# Altium schematic sheet [01] Power Suppy.SchDoc
size A4
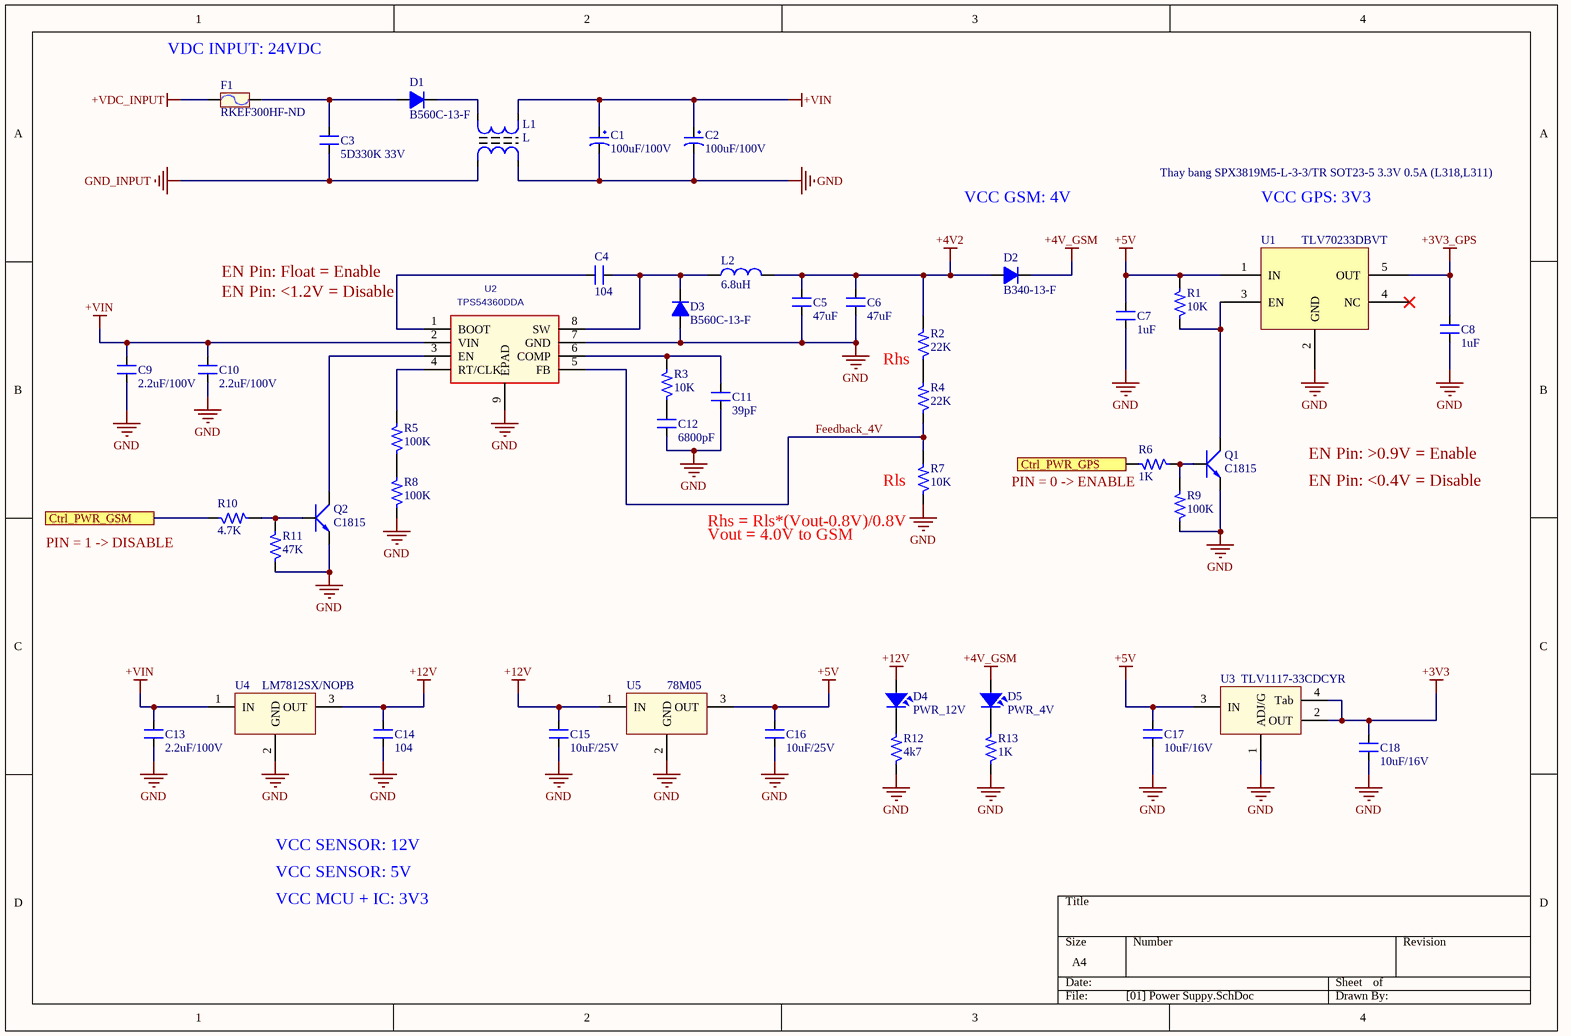
[diagram p0: [01] Power Suppy.SchDoc]

## Parts
C1  100uF/100V  [CP1.5/3.4]
C2  100uF/100V  [CP1.5/3.4]
C3  5D330K 33V  [CN2]
C4  104  [C0603 SMT]
C5  47uF  [SM-1210]
C6  47uF  [SM-1210]
C7  1uF  [CAP_0805]
C8  1uF  [CAP_0805]
C9  2.2uF/100V  [SM-1210]
C10  2.2uF/100V  [SM-1210]
C11  39pF  [CAP_0805]
C12  6800pF  [CAP_0805]
C13  2.2uF/100V  [SM-1210]
C14  104  [CAP_0805]
C15  10uF/25V  [CAP_0805]
C16  10uF/25V  [CAP_0805]
C17  10uF/16V  [CAP_0805]
C18  10uF/16V  [CAP_0805]
D1  B560C-13-F  [DO-214AB SMC]
D2  B340-13-F  [DO-214AB SMA]
D3  B560C-13-F  [DO-214AB SMC]
D4  PWR_12V  [LED-0805-Yellow]
D5  PWR_4V  [LED-0805-Green]
F1  RKEF300HF-ND  [FUSE2]
L1  L  [L2 UF9.8]
L2  6.8uH  [L01 SMD 12*12*6]
Q1  C1815  [SOT23B]
Q2  C1815  [SOT23B]
R1  10K  [RES-SMD-0805]
R2  22K  [RES-SMD-0805]
R3  10K  [RES-SMD-0805]
R4  22K  [RES-SMD-0805]
R5  100K  [RES-SMD-0805]
R6  1K  [RES-SMD-0805]
R7  10K  [RES-SMD-0805]
R8  100K  [RES-SMD-0805]
R9  100K  [RES-SMD-0805]
R10  4.7K  [RES-SMD-0805]
R11  47K  [RES-SMD-0805]
R12  4k7  [RES-SMD-0805]
R13  1K  [RES-SMD-0805]
U1  TLV70233DBVT  [TLV70233_3.3V]
U2  TPS54360DDA  [DDA8_3P1X2P4-M]
U3  TLV1117-33CDCYR  [SOT223-4N]
U4  LM7812SX/NOPB  [TO-263-4]
U5  78M05  [TO252-3L]

## Ports
Ctrl_PWR_GPS, Ctrl_PWR_GSM

## Nets
+3V3: C18.2 U3.2(OUT) U3.4(Tab)
+3V3_GPS: C8.2 U1.5(OUT)
+4V2: C5.2 C6.2 D2.1(A) L2.2 R2.2
+4V_GSM: D2.2(K) D5.1
+5V: C7.2 C16.2 C17.2 R1.2 U1.1(IN) U3.3(IN) U5.3(OUT)
+12V: C14.2 C15.2 D4.1 U4.3(OUT) U5.1(IN)
+VDC_INPUT: F1.1
+VIN: C1.1 C2.1 C9.2 C10.2 C13.2 L1.3 U2.2(VIN) U4.1(IN)
GND: C1.2 C2.2 C5.1 C6.1 C7.1 C8.1 C9.1 C10.1 C11.1 C12.1 C13.1 C14.1 C15.1 C16.1 C17.1 C18.1 D3.1(A) L1.2 Q1.1(E) Q2.1(E) R7.1 R8.1 R9.1 R11.1 R12.1 R13.1 U1.2(GND) U2.7(GND) U2.9(EPAD) U3.1(ADJ/G) U4.2(GND) U5.2(GND)
GND_INPUT: C3.1 L1.1
Ctrl_PWR_GPS: R6.2 ; port Ctrl_PWR_GPS
Ctrl_PWR_GSM: R10.1 ; port Ctrl_PWR_GSM
Feedback_4V: R4.1 R7.2 U2.5(FB)
NetC3_2: C3.2 D1.1(A) F1.2
NetC4_1: C4.1 U2.1(BOOT)
NetC4_2: C4.2 D3.2(K) L2.1 U2.8(SW)
NetC11_2: C11.2 R3.2 U2.6(COMP)
NetC12_2: C12.2 R3.1
NetD1_2: D1.2(K) L1.4
NetD4_2: D4.2 R12.2
NetD5_2: D5.2 R13.2
NetQ1_2: Q1.2(C) R1.1 U1.3(EN)
NetQ1_3: Q1.3(B) R6.1 R9.2
NetQ2_2: Q2.2(C) U2.3(EN)
NetQ2_3: Q2.3(B) R10.2 R11.2
NetR2_1: R2.1 R4.2
NetR5_1: R5.1 R8.2
NetR5_2: R5.2 U2.4(RT/CLK)

Not connected (* = marked no-connect by the designer): U1 4(NC)*

## Notes on the sheet
- (near F1) VDC INPUT: 24VDC
- Thay bang SPX3819M5-L-3-3/TR SOT23-5 3.3V 0.5A (L318,L311)
- VCC GSM: 4V
- VCC GPS: 3V3
- EN Pin: Float = Enable
- EN Pin: <1.2V = Disable
- Rhs
- (near R7) Rls
- (near R6) PIN = 0 -> ENABLE
- EN Pin: >0.9V = Enable
- EN Pin: <0.4V = Disable
- (near R10) PIN = 1 -> DISABLE
- (near R7) Rhs = Rls*(Vout-0.8V)/0.8V
- Vout = 4.0V to GSM
- VCC SENSOR: 12V
- VCC SENSOR: 5V
- VCC MCU + IC: 3V3

## Library data of the parts
C1 C2 = CP3: Cap 100uF/35V - 470uF/16V; Value: 100uF/35V/50V; Description 1: 1000uF/6,3V - 470uF/16V - 330uF - 25V; Description 2: 220uF/35V - 100uF/50V - 63V - 4,7uF/200V; Description 3: 22uF => 33uF100V - 3,3uF => 4,7uF/250V; Description 4: 2,2uF =>3,3uF/350 - 2,2uF/400V - 1uF/450V
C3 = CN: Value: 0,1uF/300V; Designed by: VanDungEvn
C4-C8 C11 C12 C14-C18 = CM_1: Cap SMD; Value: 103
C9 C10 C13 = CM: CAP CER 2.2UF 100V X7R 1210  445-4498-2-ND; Value: 103
D1 D3 = D5A: DIODE SCHOTTKY 60V 5A SMC; Value: 1N5408
D2 = D1A: DIODE SCHOTTKY 40V 3A SMC; Value: 1N4007
D4 D5 = LED: LED Single colour Green and Red; Value: LED 3 ly Single Colour
F1 = Fuse: PTC RESET FUSE 60V 3A RADIAL; Designed by: VanDungEvn; Value: Fuse
L1 = L2x220: Inductor; Value: Loc 220; Designed by: VanDungEvn
L2 = L1: FIXED IND 6.2UH 5.7A 22.4 MOHM; Value: 150 mH
Q1 Q2 = C1815: NPN 600mW, ECB; Value: C1815
R1-R5 R7-R12 = RM: Resistor SMD; Value: 1K
R6 R13 = RM: Resistor SMD; Value: 1K
U1 = TLV70233_3.3V
U2 = TPS54360DDA: REG BUCK SPLIT RAIL 8SOPWRPAD; C: Copyright (C) 2015 Accelerated Designs. All rights reserved; Vendor: TEXAS INSTRUMENTS; Built_By: EMA_UL_Team; Value: TPS54360DDA; Manufacturer_Part_Number: TPS54360DDA
U3 = LM1117: 3v3; Value: LM317
U4 = LM78xx_1: pin to pad: 2>2+4; Value: LM7805
U5 = LM78xx: On ap +, from + 5 to + 24VDC; Value: LM7805